# Altium project MainBoard.PrjPcb
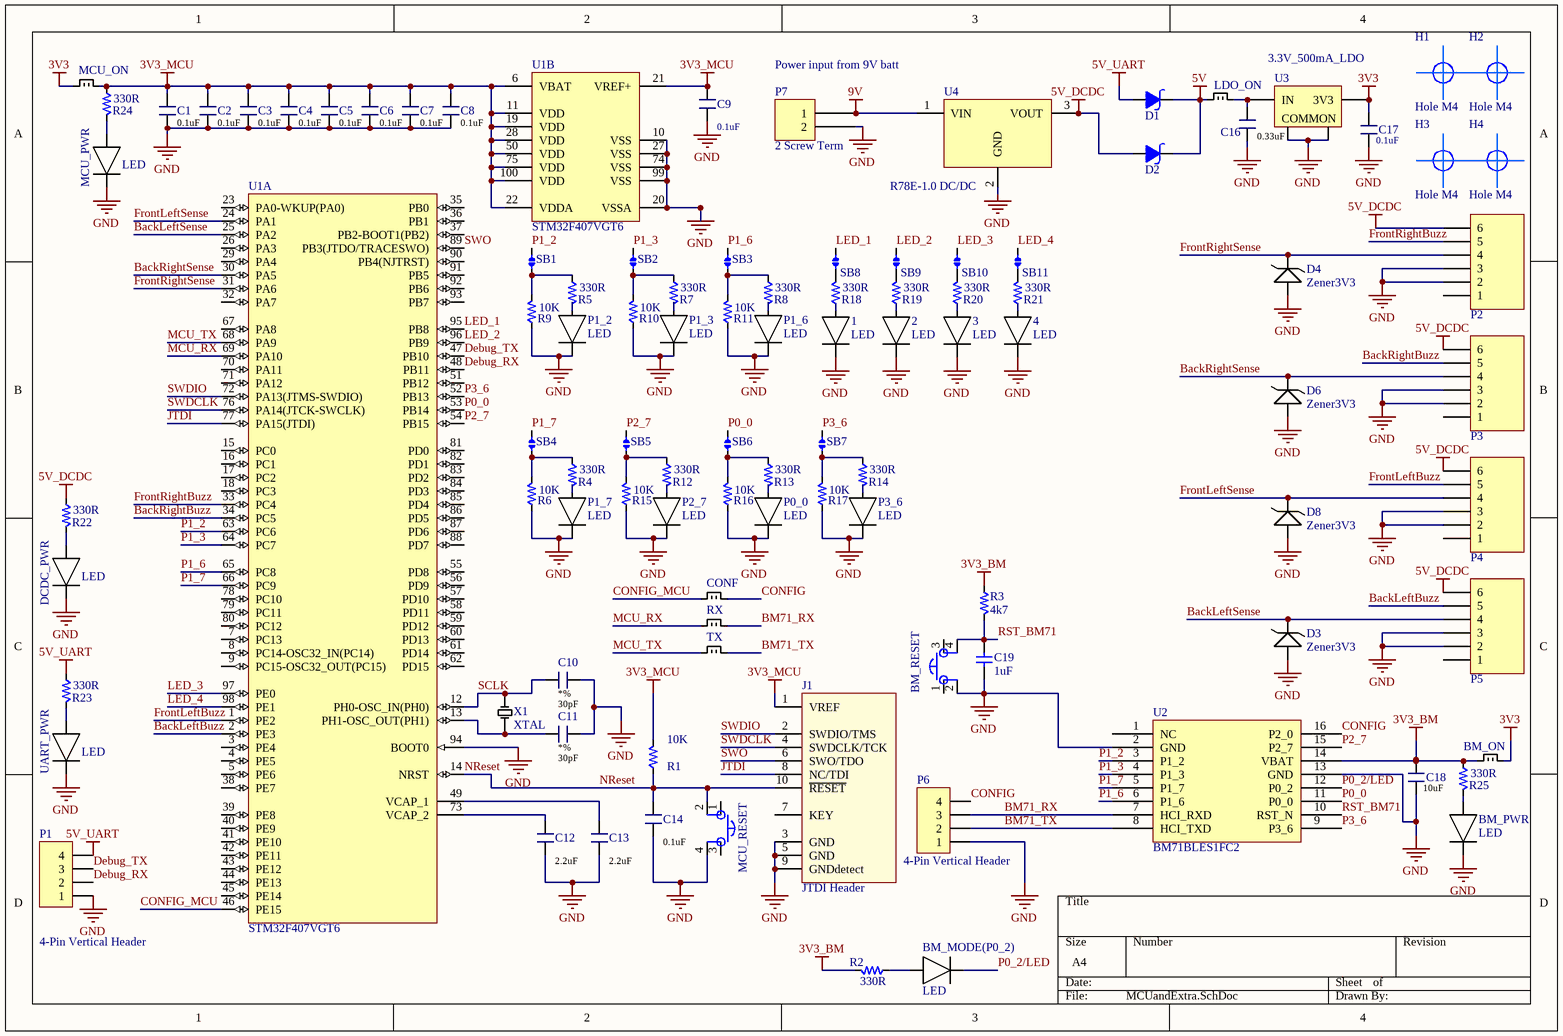
[diagram p0: MCUandExtra.SchDoc]
1 sheet, 101 parts. Net scope: global (net labels, ports and power ports of the same name join across sheets).
Board files: CC-v1-0.PcbDoc, CC-v1-1.PcbDoc

## Sheet MCUandExtra.SchDoc
size A4

### Parts
1  LED  [SMD_0603_LED]
2  LED  [SMD_0603_LED]
3  LED  [SMD_0603_LED]
4  LED  [SMD_0603_LED]
BM_MODE(P0_2)  LED  [SMD_0603_LED]
BM_ON  2.54Jump  [Jumper]  (value not drawn)
BM_PWR  LED  [SMD_0603_LED]
BM_RESET  Tactile Switch  [C&K 4 pin Tactile Switch]  (value not drawn)
C1  Capacitance: 0.1uF  [PCB_GENERIC_SMD_0603]  (hidden comment: SCH_GENERIC_CAPACITOR_0603)
C2  Capacitance: 0.1uF  [PCB_GENERIC_SMD_0603]  (hidden comment: SCH_GENERIC_CAPACITOR_0603)
C3  Capacitance: 0.1uF  [PCB_GENERIC_SMD_0603]  (hidden comment: SCH_GENERIC_CAPACITOR_0603)
C4  Capacitance: 0.1uF  [PCB_GENERIC_SMD_0603]  (hidden comment: SCH_GENERIC_CAPACITOR_0603)
C5  Capacitance: 0.1uF  [PCB_GENERIC_SMD_0603]  (hidden comment: SCH_GENERIC_CAPACITOR_0603)
C6  Capacitance: 0.1uF  [PCB_GENERIC_SMD_0603]  (hidden comment: SCH_GENERIC_CAPACITOR_0603)
C7  Capacitance: 0.1uF  [PCB_GENERIC_SMD_0603]  (hidden comment: SCH_GENERIC_CAPACITOR_0603)
C8  Capacitance: 0.1uF  [PCB_GENERIC_SMD_0603]  (hidden comment: SCH_GENERIC_CAPACITOR_0603)
C9  Capacitance: 0.1uF  [PCB_GENERIC_SMD_0603]  (hidden comment: SCH_GENERIC_CAPACITOR_0603)
C10  Tolerance: *%  Capacitance: 30pF  [PCB_GENERIC_SMD_0603]  (hidden comment: SCH_GENERIC_CAPACITOR_0603)
C11  Tolerance: *%  Capacitance: 30pF  [PCB_GENERIC_SMD_0603]  (hidden comment: SCH_GENERIC_CAPACITOR_0603)
C12  Capacitance: 2.2uF  [PCB_GENERIC_SMD_0603]  (hidden comment: SCH_GENERIC_CAPACITOR_0603)
C13  Capacitance: 2.2uF  [PCB_GENERIC_SMD_0603]  (hidden comment: SCH_GENERIC_CAPACITOR_0603)
C14  Capacitance: 0.1uF  [PCB_GENERIC_SMD_0603]  (hidden comment: SCH_GENERIC_CAPACITOR_0603)
C16  Capacitance: 0.33uF  [PCB_GENERIC_SMD_0603]  (hidden comment: SCH_GENERIC_CAPACITOR_0603)
C17  Capacitance: 0.1uF  [PCB_GENERIC_SMD_0603]  (hidden comment: SCH_GENERIC_CAPACITOR_0603)
C18  Capacitance: 10uF  [PCB_GENERIC_SMD_0603]  (hidden comment: SCH_GENERIC_CAPACITOR_0603)
C19  value 1uF  [PCB_GENERIC_SMD_0603]  (hidden comment: C060-0001U-00)
CONF  2.54Jump  [Jumper]  (value not drawn)
D1  ONSEMI_MBRM110LT1G  [ON Semi Schottky Diode - MBRM110LT1G]  (value not drawn)
D2  ONSEMI_MBRM110LT1G  [ON Semi Schottky Diode - MBRM110LT1G]  (value not drawn)
D3  Zener3V3  [Zener3V3]
D4  Zener3V3  [Zener3V3]
D6  Zener3V3  [Zener3V3]
D8  Zener3V3  [Zener3V3]
DCDC_PWR  LED  [SMD_0603_LED]
H1  Hole M4  [M4_Hole]
H2  Hole M4  [M4_Hole]
H3  Hole M4  [M4_Hole]
H4  Hole M4  [M4_Hole]
J1  JTDI Header  [CONN-50mil-10POS-SMD]
LDO_ON  2.54Jump  [Jumper]  (value not drawn)
MCU_ON  2.54Jump  [Jumper]  (value not drawn)
MCU_PWR  LED  [SMD_0603_LED]
MCU_RESET  Tactile Switch  [C&K 4 pin Tactile Switch]  (value not drawn)
P0_0  LED  [SMD_0603_LED]
P1  4-Pin Vertical Header  [4-Pin Vertical Header]
P1_2  LED  [SMD_0603_LED]
P1_3  LED  [SMD_0603_LED]
P1_6  LED  [SMD_0603_LED]
P1_7  LED  [SMD_0603_LED]
P2  SCH_MLX_MICROFIT_3X2  [PCB_MLX_MICROFIT_3X2]  (value not drawn)
P2_7  LED  [SMD_0603_LED]
P3  SCH_MLX_MICROFIT_3X2  [PCB_MLX_MICROFIT_3X2]  (value not drawn)
P3_6  LED  [SMD_0603_LED]
P4  SCH_MLX_MICROFIT_3X2  [PCB_MLX_MICROFIT_3X2]  (value not drawn)
P5  SCH_MLX_MICROFIT_3X2  [PCB_MLX_MICROFIT_3X2]  (value not drawn)
P6  4-Pin Vertical Header  [4-Pin Vertical Header]
P7  2 Screw Term  [PCBComponent_1]
R1  Resistance: 10K  [PCB_GENERIC_SMD_0603]  (hidden comment: SCH_GENERIC_RESISTOR_0603)
R2  Resistance: 330R  [PCB_GENERIC_SMD_0603]  (hidden comment: SCH_GENERIC_RESISTOR_0603)
R3  Resistance: 4k7  [PCB_GENERIC_SMD_0603]  (hidden comment: SCH_GENERIC_RESISTOR_0603)
R4  Resistance: 330R  [PCB_GENERIC_SMD_0603]  (hidden comment: SCH_GENERIC_RESISTOR_0603)
R5  Resistance: 330R  [PCB_GENERIC_SMD_0603]  (hidden comment: SCH_GENERIC_RESISTOR_0603)
R6  Resistance: 10K  [PCB_GENERIC_SMD_0603]  (hidden comment: SCH_GENERIC_RESISTOR_0603)
R7  Resistance: 330R  [PCB_GENERIC_SMD_0603]  (hidden comment: SCH_GENERIC_RESISTOR_0603)
R8  Resistance: 330R  [PCB_GENERIC_SMD_0603]  (hidden comment: SCH_GENERIC_RESISTOR_0603)
R9  Resistance: 10K  [PCB_GENERIC_SMD_0603]  (hidden comment: SCH_GENERIC_RESISTOR_0603)
R10  Resistance: 10K  [PCB_GENERIC_SMD_0603]  (hidden comment: SCH_GENERIC_RESISTOR_0603)
R11  Resistance: 10K  [PCB_GENERIC_SMD_0603]  (hidden comment: SCH_GENERIC_RESISTOR_0603)
R12  Resistance: 330R  [PCB_GENERIC_SMD_0603]  (hidden comment: SCH_GENERIC_RESISTOR_0603)
R13  Resistance: 330R  [PCB_GENERIC_SMD_0603]  (hidden comment: SCH_GENERIC_RESISTOR_0603)
R14  Resistance: 330R  [PCB_GENERIC_SMD_0603]  (hidden comment: SCH_GENERIC_RESISTOR_0603)
R15  Resistance: 10K  [PCB_GENERIC_SMD_0603]  (hidden comment: SCH_GENERIC_RESISTOR_0603)
R16  Resistance: 10K  [PCB_GENERIC_SMD_0603]  (hidden comment: SCH_GENERIC_RESISTOR_0603)
R17  Resistance: 10K  [PCB_GENERIC_SMD_0603]  (hidden comment: SCH_GENERIC_RESISTOR_0603)
R18  Resistance: 330R  [PCB_GENERIC_SMD_0603]  (hidden comment: SCH_GENERIC_RESISTOR_0603)
R19  Resistance: 330R  [PCB_GENERIC_SMD_0603]  (hidden comment: SCH_GENERIC_RESISTOR_0603)
R20  Resistance: 330R  [PCB_GENERIC_SMD_0603]  (hidden comment: SCH_GENERIC_RESISTOR_0603)
R21  Resistance: 330R  [PCB_GENERIC_SMD_0603]  (hidden comment: SCH_GENERIC_RESISTOR_0603)
R22  Resistance: 330R  [PCB_GENERIC_SMD_0603]  (hidden comment: SCH_GENERIC_RESISTOR_0603)
R23  Resistance: 330R  [PCB_GENERIC_SMD_0603]  (hidden comment: SCH_GENERIC_RESISTOR_0603)
R24  Resistance: 330R  [PCB_GENERIC_SMD_0603]  (hidden comment: SCH_GENERIC_RESISTOR_0603)
R25  Resistance: 330R  [PCB_GENERIC_SMD_0603]  (hidden comment: SCH_GENERIC_RESISTOR_0603)
RX  2.54Jump  [Jumper]  (value not drawn)
SB1  N/O  [SB_NO]  (value not drawn)  (no BOM)
SB2  N/O  [SB_NO]  (value not drawn)  (no BOM)
SB3  N/O  [SB_NO]  (value not drawn)  (no BOM)
SB4  N/O  [SB_NO]  (value not drawn)  (no BOM)
SB5  N/O  [SB_NO]  (value not drawn)  (no BOM)
SB6  N/O  [SB_NO]  (value not drawn)  (no BOM)
SB7  N/O  [SB_NO]  (value not drawn)  (no BOM)
SB8  N/O  [SB_NO]  (value not drawn)  (no BOM)
SB9  N/O  [SB_NO]  (value not drawn)  (no BOM)
SB10  N/O  [SB_NO]  (value not drawn)  (no BOM)
SB11  N/O  [SB_NO]  (value not drawn)  (no BOM)
TX  2.54Jump  [Jumper]  (value not drawn)
U1  STM32F407VGT6  [STM-LQFP100_N]  (parts A,B of 2)
U2  BM71BLES1FC2  [BM71BLES1FC2]
U3  3.3V_500mA_LDO  [3.3V_500mA_LDO]
U4  R78E-1.0 DC/DC  [R78-1.0]
UART_PWR  LED  [SMD_0603_LED]
X1  XTAL  [CRYSTAL_8MHZ]

### Nets
3V3: BM_ON.2 C17.2 MCU_ON.1 U3.3(3V3)
3V3_BM: BM_ON.1 C18.2 R2.2 R3.1 R25.1 U2.14(VBAT)
3V3_MCU: C1.2 C2.2 C3.2 C4.2 C5.2 C6.2 C7.2 C8.2 C9.2 J1.1(VREF) MCU_ON.2 R1.2 R24.1 U1.6(VBAT) U1.11(VDD) U1.19(VDD) U1.21(VREF+) U1.22(VDDA) U1.28(VDD) U1.50(VDD) U1.75(VDD) U1.100(VDD)
5V: D1.1 D2.1 LDO_ON.1
5V_DCDC: D2.2 P2.6 P3.6 P4.6 P5.6 R22.1 U4.3(VOUT)
5V_UART: D1.2 P1.4 R23.1
9V: P7.1 U4.1(VIN)
GND: 1.2 2.2 3.2 4.2 BM_PWR.2 BM_RESET.2 C1.1 C2.1 C3.1 C4.1 C5.1 C6.1 C7.1 C8.1 C9.1 C10.1 C11.1 C12.1 C13.1 C14.2 C16.2 C17.1 C18.1 C19.1 D3.2 D4.2 D6.2 D8.2 DCDC_PWR.2 J1.3(GND) J1.5(GND) J1.9(GNDdetect) MCU_PWR.2 MCU_RESET.4 P0_0.2 P1.1 P1_2.2 P1_3.2 P1_6.2 P1_7.2 P2.2 P2.3 P2_7.2 P3.2 P3.3 P3_6.2 P4.2 P4.3 P5.2 P5.3 P6.1 P7.2 R6.1 R9.1 R10.1 R11.1 R15.1 R16.1 R17.1 U1.10(VSS) U1.20(VSSA) U1.27(VSS) U1.74(VSS) U1.94(BOOT0) U1.99(VSS) U2.2(GND) U2.13(GND) U3.2(GND) U3.4(GND) U4.2(GND) UART_PWR.2
BackLeftBuzz: P5.5 U1.2(PE3)
BackLeftSense: D3.1 P5.4 U1.25(PA2)
BackRightBuzz: P3.5 U1.34(PC5)
BackRightSense: D6.1 P3.4 U1.30(PA5)
BM71_RX: P6.3 RX.2 U2.7(HCI_RXD)
BM71_TX: P6.2 TX.2 U2.8(HCI_TXD)
CONFIG: CONF.2 P6.4 U2.16(P2_0)
CONFIG_MCU: CONF.1 U1.46(PE15)
Debug_RX: P1.2 U1.48(PB11)
Debug_TX: P1.3 U1.47(PB10)
FrontLeftBuzz: P4.5 U1.1(PE2)
FrontLeftSense: D8.1 P4.4 U1.24(PA1)
FrontRightBuzz: P2.5 U1.33(PC4)
FrontRightSense: D4.1 P2.4 U1.31(PA6)
JTDI: J1.8(NC/TDI) U1.77(PA15(JTDI))
LED_1: SB8.2 U1.95(PB8)
LED_2: SB9.2 U1.96(PB9)
LED_3: SB10.2 U1.97(PE0)
LED_4: SB11.2 U1.98(PE1)
MCU_RX: RX.1 U1.69(PA10)
MCU_TX: TX.1 U1.68(PA9)
NReset: C14.1 J1.10(~{RESET}) MCU_RESET.2 R1.1 U1.14(NRST)
P0_0: SB6.2 U1.53(PB14) U2.11(P0_0)
P0_2/LED: BM_MODE(P0_2).2 U2.12(P0_2)
P1_2: SB1.2 U1.63(PC6) U2.3(P1_2)
P1_3: SB2.2 U1.64(PC7) U2.4(P1_3)
P1_6: SB3.2 U1.65(PC8) U2.6(P1_6)
P1_7: SB4.2 U1.66(PC9) U2.5(P1_7)
P2_7: SB5.2 U1.54(PB15) U2.15(P2_7)
P3_6: SB7.2 U1.52(PB13) U2.9(P3_6)
RST_BM71: BM_RESET.4 C19.2 R3.2 U2.10(RST_N)
SCLK: C10.2 U1.12(PH0-OSC_IN(PH0)) X1.1
SWDCLK: J1.4(SWDCLK/TCK) U1.76(PA14(JTCK-SWCLK))
SWDIO: J1.2(SWDIO/TMS) U1.72(PA13(JTMS-SWDIO))
SWO: J1.6(SWO/TDO) U1.89(PB3(JTDO/TRACESWO))
Net1_1: 1.1 R18.1
Net2_1: 2.1 R19.1
Net3_1: 3.1 R20.1
Net4_1: 4.1 R21.1
NetBM_MODE(P0_2)_1: BM_MODE(P0_2).1 R2.1
NetBM_PWR_1: BM_PWR.1 R25.2
NetC11_2: C11.2 U1.13(PH1-OSC_OUT(PH1)) X1.2
NetC12_2: C12.2 U1.73(VCAP_2)
NetC13_2: C13.2 U1.49(VCAP_1)
NetC16_1: C16.1 LDO_ON.2 U3.1(IN)
NetDCDC_PWR_1: DCDC_PWR.1 R22.2
NetMCU_PWR_1: MCU_PWR.1 R24.2
NetP0_0_1: P0_0.1 R13.2
NetP1_2_1: P1_2.1 R5.2
NetP1_3_1: P1_3.1 R7.2
NetP1_6_1: P1_6.1 R8.2
NetP1_7_1: P1_7.1 R4.2
NetP2_7_1: P2_7.1 R12.2
NetP3_6_1: P3_6.1 R14.2
NetR4_1: R4.1 R6.2 SB4.1
NetR5_1: R5.1 R9.2 SB1.1
NetR7_1: R7.1 R10.2 SB2.1
NetR8_1: R8.1 R11.2 SB3.1
NetR12_1: R12.1 R15.2 SB5.1
NetR13_1: R13.1 R16.2 SB6.1
NetR14_1: R14.1 R17.2 SB7.1
NetR18_2: R18.2 SB8.1
NetR19_2: R19.2 SB9.1
NetR20_2: R20.2 SB10.1
NetR21_2: R21.2 SB11.1
NetR23_2: R23.2 UART_PWR.1

Not connected (* = marked no-connect by the designer): BM_RESET 1 3; J1 7(KEY); MCU_RESET 1 3; P2 1; P3 1; P4 1; P5 1; U1 3(PE4) 4(PE5) 5(PE6) 7(PC13) 8(PC14-OSC32_IN(PC14)) 9(PC15-OSC32_OUT(PC15)) 15(PC0) 16(PC1) 17(PC2) 18(PC3) 23(PA0-WKUP(PA0)) 26(PA3) 29(PA4) 32(PA7) 35(PB0) 36(PB1) 37(PB2-BOOT1(PB2)) 38(PE7) 39(PE8) 40(PE9) 41(PE10) 42(PE11) 43(PE12) 44(PE13) 45(PE14) 51(PB12) 55(PD8) 56(PD9) 57(PD10) 58(PD11) 59(PD12) 60(PD13) 61(PD14) 62(PD15) 67(PA8) 70(PA11) 71(PA12) 78(PC10) 79(PC11) 80(PC12) 81(PD0) 82(PD1) 83(PD2) 84(PD3) 85(PD4) 86(PD5) 87(PD6) 88(PD7) 90(PB4(NJTRST)) 91(PB5) 92(PB6) 93(PB7); U2 1(NC)

### Notes on the sheet
- Power input from 9V batt
- (in symbol 3.3V_500mA) COMMON

### Library data of the parts
1-4 BM_MODE(P0_2) BM_PWR DCDC_PWR MCU_PWR P0_0 P1_2 P1_3 P1_6 P1_7 P2_7 P3_6 UART_PWR = SMD_0603_LED
BM_ON CONF LDO_ON MCU_ON RX TX = Jumper: WM23943-ND
BM_RESET MCU_RESET = C&K Tactile Switch: Supplier 1: Digi-Key; Supplier Part Number 1: CKN9085CT-ND
C1-C8 C12-C14 C16 C18 = SCH_GENERIC_CAPACITOR_0603: Generic SMD capacitor 0603; Tolerance: *%
C9-C11 C17 = SCH_GENERIC_CAPACITOR_0603: Generic SMD capacitor 0603
C19 = C060-0001U-00: CAP CER 0603 1uF 16V X5R 20%; Tolerance: 20%; Voltage: 16V; Package: 0603
D1 D2 = ONSEMI_MBRM110LT1G: DIODE SCHOTTKY 10V 1A; Supplier 1: Digi-Key; Supplier Part Number 1: MBRM110LT1GOSDKR-ND
D3 D4 D6 D8 = DZ2W03300LCT-ND
H1-H4 = Component_1
J1 = conn_0.050"_cortexM: ARM Cortex-M 10pin connector,shrouded,SMT; Supplier 1: Digi-Key; Supplier Part Number 1: 1175-1629-ND
P1 P6 = 4-Pin Vertical Header: Manufacturer: Sullins; Manufacturer No.: PPPC041LFBN-RC
R1-R25 = SCH_GENERIC_RESISTOR_0603: Generic SMD resistor 0603
SB1-SB11 = SB_NO: Solder Bridge, Normally Open
U1 = STM32F407VGT6: ARM Cortex-M4 32-bit MCU+FPU, 210 DMIPS, 1024 kB Flash, 192 kB Internal RAM, 82 I/Os, 100-pin LQFP, -40 to 85 degC, Tray; Manufacturer: STMicroelectronics; D/A Converter: 2x12-bit; FLASH Size (Prog) (kB): 1024; I/Os (High Current): 82; Internal RAM Size (kB): 192; Operating Frequency(F) (Processor speed) (MHz): 168; Supply Voltage(Vcc) max (V): 3.6; Supply Voltage(Vcc) min (V): 1.8; DatasheetVersion: Rev. 4; PackageVersion: Rev. 1, 06/2013; PackageReference: LQFP100; PackageDescription: 100-Pin Low Profile Quad Flat Package, 14 x 14 mm Body, 0.5 mm Pitch; Supplier 1: Digi-Key; Supplier Part Number 1: 497-11605-ND; Supplier 2: Farnell; Supplier Part Number 2: 2064368; Supplier 3: Newark; Supplier Part Number 3: 73T2333; Supplier 4: Mouser; Supplier Part Number 4: 511-STM32F407VGT6; Core: ARM Cortex-M4; Packing: Tray; Mounting Technology: Surface Mount; PartNumber: STM32F407VGT6; ComponentLink1Description: Manufacturer URL; ComponentLink1URL: http://www.st.com/web/en/home.html; ComponentLink2Description: Datasheet; ComponentLink2URL: http://www.st.com/st-web-ui/static/active/en/resource/technical/document/datasheet/DM00037051.pdf; ComponentLink3Description: Package Specification; ComponentLink3URL: http://www.st.com/st-web-ui/static/active/en/resource/technical/document/data_brief/DM00071938.pdf
U2 = BM71 Bluetooth Module
U3 = 3.3V_500mA: IC REG LIN 3.3V 500MA SOT223-4; Supplier: Digikey; Supplier Part Number: 296-13424-1-ND
U4 = R78E-1.0
X1 = Crystal: Frequency: 8MHz
P7 = 2 Screw Term: Supplier: Digikey; Supplier Part Number: 1297-1108-1-ND